# Altium schematic sheet 1_P1.schdoc.schdoc
size 309 x 223 mm; Symbol: Sheet-Symbol_A3; Device: Sheet-Symbol_A3; Company: 嘉立创EDA; Version: V1.0; Page Size: A3; @Project Name: WotageiStick; @Page Count: 1; @Update Date: 2023-12-18; @Create Date: 2023-12-17; @Schematic Name: Schematic2; @Page No: 1; @Page Name: P1
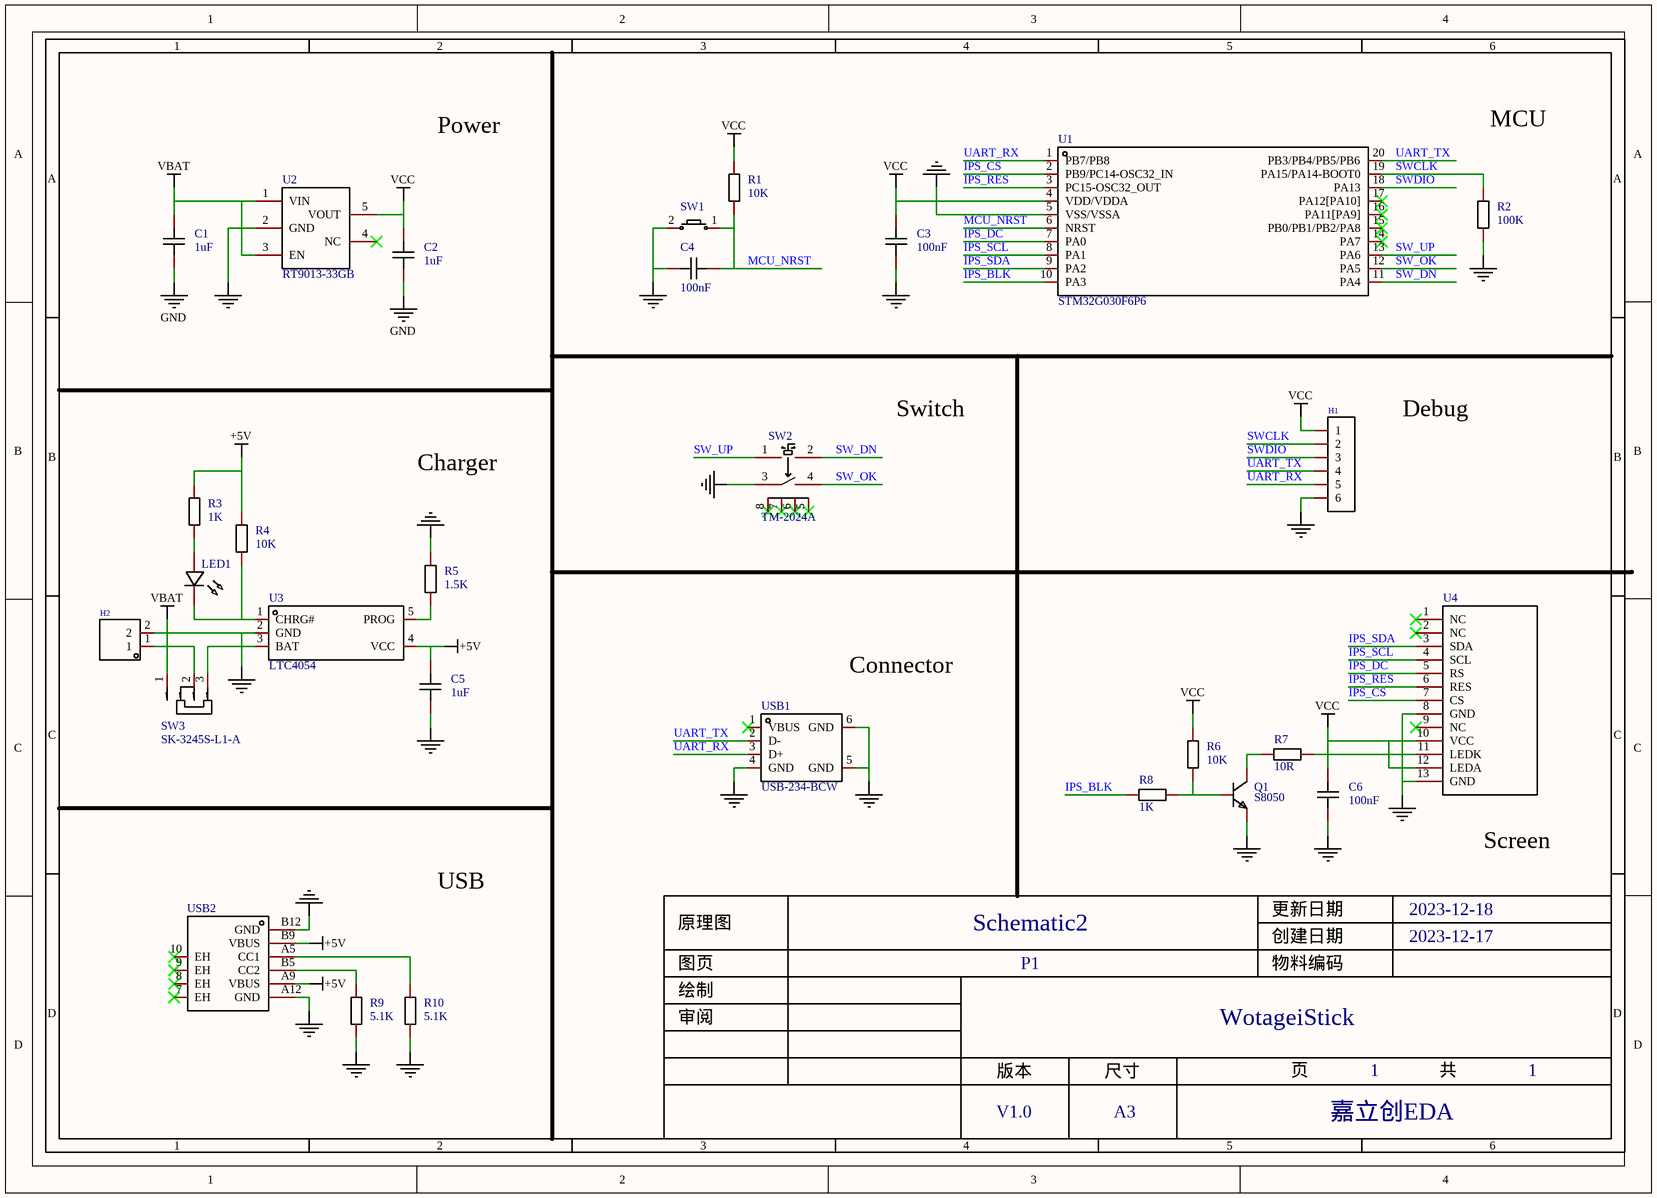
[diagram p0: 1_P1.schdoc.schdoc]

## Parts
C1  1uF  [C0603]
C2  1uF  [C0603]
C3  100nF  [C0603]
C4  100nF  [C0603]
C5  1uF  [C0603]
C6  100nF  [C0603]
H1  HDR-M_2.54_1x6P  [HDR-TH_6P-P2.54-V-M-1]  (value not drawn)
H2  HDR-M_2.54_1x2P  [HDR-TH_2P-P2.54-V-M-1]  (value not drawn)
LED1  LED_0603-R  [LED_0603]  (value not drawn)
Q1  S8050  [SOT-23-3_L2.9-W1.3-P1.90-LS2.4-BR]
R1  10K  [R0603]
R2  100K  [R0603]
R3  1K  [R0603]
R4  10K  [R0603]
R5  1.5K  [R0603]
R6  10K  [R0603]
R7  10R  [R0603]
R8  1K  [R0603]
R9  5.1K  [R0603]
R10  5.1K  [R0603]
SW1  Key_SMD_3x4x2  [Key_SMD_3x4x2]  (value not drawn)
SW2  TM-2024A  [SW-SMD_TM-2024A]
SW3  SK-3245S-L1-A  [SW-SMD_SK-3245S-L1-A-1]
U1  STM32G030F6P6  [TSSOP-20_L6.5-W4.4-P0.65-LS6.4-BL]
U2  RT9013-33GB  [SOT-23-5_L3.0-W1.7-P0.95-LS2.8-BL]
U3  LTC4054  [SOT-23-5_L3.0-W1.7-P0.95-LS2.8-BL]
U4  TFT显示模块 0.96寸TFT 13PIN ST7735S  [N096-1608TBBIG11-H13]  (value not drawn)
USB1  USB-234-BCW  [USB-A-SMD_USB-234-BCW]
USB2  USB_ Type-C-6P  [USB_ TYPE-C-6P]  (value not drawn)

## Nets
+5V: C5.2 R3.1 R4.1 U3.4(VCC) USB2.A9(VBUS) USB2.B9(VBUS)
GND: C1.1 C2.1
NetC3_1: C3.1 C4.1 C5.1 C6.1 H1.6 H2.2 Q1.2(E) R2.2 R5.1 R9.1 R10.2 SW1.2 SW2.3 U1.5(VSS/VSSA) U2.2(GND) U3.2(GND) U4.8(GND) U4.13(GND) USB1.4(GND) USB1.5(GND) USB1.6(GND) USB2.A12(GND) USB2.B12(GND)
VBAT: C1.2 SW3.1 U2.1(VIN) U2.3(EN)
VCC: C2.2 C3.2 C6.2 H1.1 R1.1 R6.2 U1.4(VDD/VDDA) U2.5(VOUT) U4.10(VCC) U4.12(LEDA)
IPS_BLK: R8.1 U1.10(PA3)
IPS_CS: U1.2(PB9/PC14-OSC32_IN) U4.7(CS)
IPS_DC: U1.7(PA0) U4.5(RS)
IPS_RES: U1.3(PC15-OSC32_OUT) U4.6(RES)
IPS_SCL: U1.8(PA1) U4.4(SCL)
IPS_SDA: U1.9(PA2) U4.3(SDA)
MCU_NRST: C4.2 R1.2 SW1.1 U1.6(NRST)
SW_DN: SW2.2 U1.11(PA4)
SW_OK: SW2.4 U1.12(PA5)
SW_UP: SW2.1 U1.13(PA6)
SWCLK: H1.2 R2.1 U1.19(PA15/PA14-BOOT0)
SWDIO: H1.3 U1.18(PA13)
UART_RX: H1.5 U1.1(PB7/PB8) USB1.3(D+)
UART_TX: H1.4 U1.20(PB3/PB4/PB5/PB6) USB1.2(D-)
NetH2_1: H2.1 SW3.2
NetLED1_1: LED1.1(C) R4.2 U3.1(CHRG#)
NetLED1_2: LED1.2(A) R3.2
NetQ1_1: Q1.1(B) R6.1 R8.2
NetQ1_3: Q1.3(C) R7.1
NetR5_2: R5.2 U3.5(PROG)
NetR7_2: R7.2 U4.11(LEDK)
NetR9_2: R9.2 USB2.B5(CC2)
NetR10_1: R10.1 USB2.A5(CC1)
NetSW3_3: SW3.3 U3.3(BAT)

Not connected (* = marked no-connect by the designer): SW2 5* 6* 7* 8*; U1 14(PA7)* 15(PB0/PB1/PB2/PA8)* 16(PA11[PA9])* 17(PA12[PA10])*; U2 4(NC)*; U4 1(NC)* 2(NC)* 9(NC)*; USB1 1(VBUS)*; USB2 7(EH)* 8(EH)* 9(EH)* 10(EH)*

## Notes on the sheet
- Power
- MCU
- Charger
- Switch
- Debug
- (near USB1) Connector
- Screen
- USB
- 1
- 2
- 3
- 4
- 5
- 6
- A
- B
- C
- 原理图
- Schematic2
- 创建日期
- 更新日期
- 2023-12-18
- 2023-12-17
- D
- 审阅
- 绘制
- 图页
- P1
- 物料编码
- WotageiStick
- 版本
- 尺寸
- 页
- 共
- V1.0
- A3
- 嘉立创EDA

## Library data of the parts
C1-C6 = CAP_0603: Symbol: CapAcitance; Convert to PCB: yes; Device: CAP_0603; Add into BOM: yes; Supplier Footprint: 0603
  C1 C2 C5: Name: 1uF; Value: 1uF
  C3 C4 C6: Name: 100nF; Value: 100nF
H1 = HDR-M_2.54_1x6P: Manufacturer: BOOMELE(博穆精密); Manufacturer Part: 2.54-1x6P直针; Symbol: Header-Male-2.54_1x6; Convert to PCB: yes; Device: HDR-M_2.54_1x6P; Supplier: LCSC; Supplier Part: C37208; JLCPCB Part Class: Extended Part; Add into BOM: yes; Supplier Footprint: 插件
H2 = HDR-M_2.54_1x2P: Manufacturer: Ckmtw(灿科盟); Manufacturer Part: B-2100S02P-A110; Symbol: 210S-1*2P L=11.6MMGold-plated black; Convert to PCB: yes; Device: HDR-M_2.54_1x2P; Supplier: LCSC; Supplier Part: C124375; JLCPCB Part Class: Extended Part; Add into BOM: yes; Supplier Footprint: 插件
LED1 = LED_0603-R: Symbol: LED_R; Convert to PCB: yes; Device: LED_0603-R; Add into BOM: yes; Supplier Footprint: 0603
Q1 = S8050_C2891804: Manufacturer: YONGYUTAI(永裕泰); Add into BOM: yes; Transistor Type: NPN; Collector Current (Ic): 500mA; Collector-Emitter Breakdown Voltage (Vceo): 25V; Power Dissipation (Pd): 300mW; Collector Cut-Off Current (Icbo): 1uA; Collector-Emitter Saturation Voltage (VCE(sat)@Ic,Ib): 500mV@500mA,50mA; Description: 晶体管类型:NPN;集电极电流(Ic):500mA;集射极击穿电压(Vceo):25V;功率(Pd):300mW;; Name: S8050; Symbol: S8050_C2891804; Device: S8050_C2891804; Supplier: LCSC; Supplier Part: C2891804; Manufacturer Part: S8050; JLCPCB Part Class: Extended Part; LCSC Part Name: 耐压:25V 电流:500mA NPN; Supplier Footprint: SOT-23; Datasheet: https://atta.szlcsc.com/upload/public/pdf/source/20210901/5347316A10609C628D4D69AE01446E5B.pdf; Convert to PCB: yes; Transition Frequency (fT): -; Operating Temperature: +150℃@(Tj)
R1-R10 = Res_0603: Symbol: 电阻; Convert to PCB: yes; Device: Res_0603; Add into BOM: yes; Supplier Footprint: 0603
  R1 R4 R6: Name: 10K; Value: 10K
  R2: Name: 100K; Value: 100K
  R3 R8: Name: 1K; Value: 1K
  R5: Name: 1.5K; Value: 1.5K
  R7: Name: 10R; Value: 10R
  R9 R10: Name: 5.1K; Value: 5.1K
SW1 = Key_SMD_3x4x2: Symbol: 轻触按键x2; Convert to PCB: yes; Device: Key_SMD_3x4x2; Add into BOM: yes; Supplier Footprint: SMD
SW2 = TM-2024A: Manufacturer: XKB Connectivity(中国星坤); Add into BOM: yes; Name: TM-2024A; Symbol: TM-2024A; Device: TM-2024A; LCSC Part Name: 四脚两档拨轮开关TM-2024A; Supplier Part: C561480; Manufacturer Part: TM-2024A; Supplier Footprint: SMD; JLCPCB Part Class: 扩展库; Datasheet: https://atta.szlcsc.com/upload/public/pdf/source/20211011/7A4DB3DC37E7D5823B6D92C66ED3191E.pdf; Supplier: LCSC; Convert to PCB: yes
SW3 = SK-3245S-L1-A: Manufacturer: XKB Connectivity(中国星坤); Add into BOM: yes; Circuit: 双刀双掷; Actuator Style: 矩形柱状; Pin Style: SMD接片; Switch Length: 9.1mm; Switch Width: 3.55mm; Switch Height: 3.2mm; Actuator Color: 黑色; Current Rating (DC): 50mA; Voltage Rating (DC): 12V; Mechanical Life: 1万次; Description: 电路结构:双刀双掷;安装方式:卧贴;开关颜色:黑色;额定电流(DC):50mA;额定电压(DC):12V;额定电流(AC):50mA;额定电压(AC):12V;机械寿命:1万次;; Name: SK-3245S-L1-A; Symbol: SK-3245S-L1-A; Device: SK-3245S-L1-A; Supplier: LCSC; Supplier Part: C405951; Manufacturer Part: SK-3245S-L1-A; JLCPCB Part Class: 扩展库; LCSC Part Name: 柄长2mm 卧贴双档 滑动开关; Supplier Footprint: SMD; Datasheet: https://atta.szlcsc.com/upload/public/pdf/source/20200227/C405951_CBAB505F81ACCB08512C6DA919ADD92C.pdf; Convert to PCB: yes; Mounting Style: 卧贴; Current Rating (AC): 50mA; Voltage Rating (AC): 12V; Operating Temperature: -40℃~+85℃
U1 = STM32G030F6P6: Manufacturer: ST(意法半导体); Add into BOM: yes; Name: STM32G030F6P6; Symbol: STM32G030F6P6; Device: STM32G030F6P6; LCSC Part Name: STM32G030F6P6; Supplier Part: C724040; Manufacturer Part: STM32G030F6P6; Supplier Footprint: TSSOP-20; JLCPCB Part Class: 扩展库; Datasheet: https://atta.szlcsc.com/upload/public/pdf/source/20200511/C529329_A1CB615556C746C4EA827FCAD1461480.pdf; Supplier: LCSC; Convert to PCB: yes
U2 = RT9013-33GB: Manufacturer: RICHTEK(立锜); Add into BOM: yes; Output Type: 固定; Output Polarity: 正; Number of Outputs: 1; Maximum Input Voltage: 5.5V; Output Voltage: 3.3V; Dropout Voltage: 400mV@(500mA); Quiescent Current (Ground Current): 50uA; Output Current: 500mA; Power Supply Rejection Ratio (PSRR): 50dB@(10kHz); Description: 输出类型:固定;输出极性:正;最大输入电压:5.5V;输出电压:3.3V;输出电流:500mA;电源纹波抑制比(PSRR):50dB@(10kHz);; Name: RT9013-33GB; Symbol: RT9013-33GB; Device: RT9013-33GB; Supplier: LCSC; Manufacturer Part: RT9013-33GB; Supplier Part: C47773; JLCPCB Part Class: 扩展库; LCSC Part Name: 输入5.5V 输出3.3V 500mA; Supplier Footprint: SOT-23-5; Datasheet: https://atta.szlcsc.com/upload/public/pdf/source/20150504/1457707282459.pdf; Convert to PCB: yes; Noise: -; Feature: -; Operating Temperature: -40℃~+85℃
U3 = LTC4054ES5-4.2#PBF: Manufacturer: ADI(亚德诺)/LINEAR(凌特); Add into BOM: yes; Description: 具有热调节功能的独立线性锂离子电池充电器; Name: LTC4054; Symbol: LTC4054ES5-4.2#PBF; Device: LTC4054ES5-4.2#PBF; LCSC Part Name: LTC4054ES5-4.2#PBF; Supplier Part: C117064; Manufacturer Part: LTC4054; Supplier Footprint: SOT-23-5; JLCPCB Part Class: 扩展库; Datasheet: https://atta.szlcsc.com/upload/public/pdf/source/20170712/C117064_1499832277334814248.pdf; Supplier: LCSC; Convert to PCB: yes
U4 = TFT显示模块 0.96寸TFT 13PIN ST7735S: Convert to PCB: yes; Symbol: TFT显示模块 0.96寸TFT 13PIN ST7735S; Device: TFT显示模块 0.96寸TFT 13PIN ST7735S; Add into BOM: yes
USB1 = USB-234-BCW: Manufacturer: XUNPU(讯普); Add into BOM: yes; Connector Type: Type-A; Gender: 母; Number of Ports: 1; Number of Contacts: 4P; Current Rating - Power (Max): 1.5A; Welding Temperature (Max): 260℃; Description: 连接器类型:Type-A;标准:USB 2.0;公母:母;端口数量:1;触点数量:4P;安装方式:卧贴;额定电流 - 电源:1.5A;工作温度范围:-20℃~+70℃;焊接温度(最大值):260℃;; Name: USB-234-BCW; Symbol: USB-234-BCW; Device: USB-234-BCW; Supplier: LCSC; Supplier Part: C720528; Manufacturer Part: USB-234-BCW; JLCPCB Part Class: Extended Part; LCSC Part Name: Type-A 母 卧贴; Supplier Footprint: SMD; Datasheet: https://atta.szlcsc.com/upload/public/pdf/source/20200810/C720528_E4736DAF0BDC0C92527D8BAAAC86B8A5.pdf; Convert to PCB: yes; Standard: USB 2.0; Mounting Style: 卧贴; Operating Temperature Range: -20℃~+70℃
USB2 = USB_ Type-C-6P: Add into BOM: yes; Symbol: USB_ TYPE-C-6P; Device: USB_ Type-C-6P; Supplier Footprint: SMD; Convert to PCB: yes